# EAGLE schematic electronicProject (EAGLE 8.6.3)
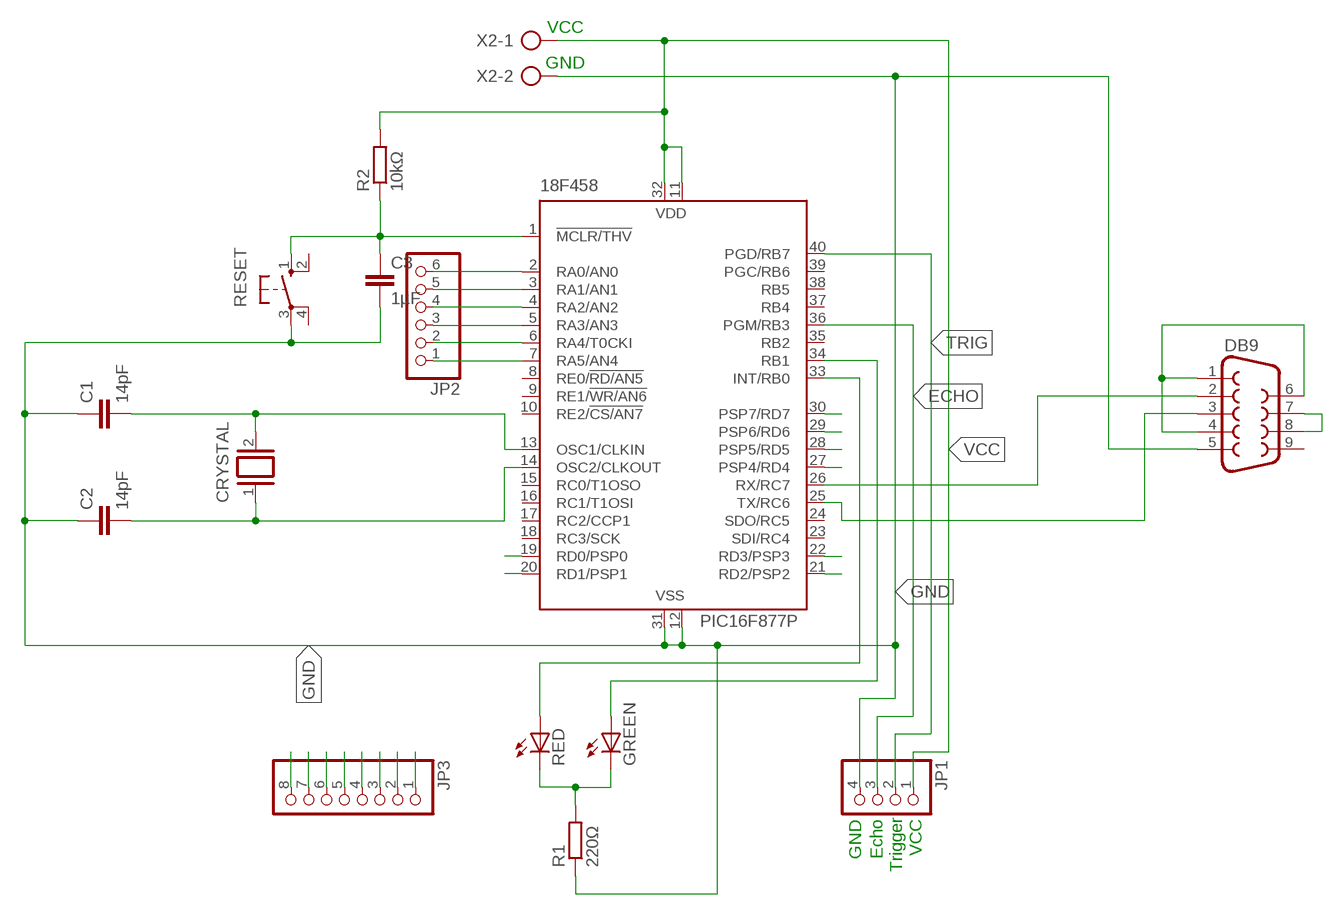
[diagram p0: schematic, sheet 1]

## Parts
18F458  PIC16F877P  [DIL40]
C1  14pF  C-EU025-024X044  [C025-024X044]
C2  14pF  C-EU025-024X044  [C025-024X044]
C3  1µF  C-EU025-024X044  [C025-024X044]
CRYSTAL  XTAL/S  [QS]
DB9  F09H  [F09H]
GREEN  LED3MM  [LED3MM]
JP1  PINHD-1X4  [1X04]
JP2  PINHD-1X6  [1X06]
JP3  PINHD-1X8  [1X08]
R1  220Ω  R-EU_0207/10  [0207/10]
R2  10kΩ  R-EU_0207/10  [0207/10]
RED  LED3MM  [LED3MM]
RESET  10-XX  [B3F-10XX]
X2  AK300/2  [AK300/2]

## Nets
ECHO: 18F458.36(PGM/RB3) JP1.3
GND: 18F458.12(VSS) 18F458.31(VSS) C1.1 C2.1 C3.2 DB9.5 JP1.4 R1.1 RESET.3(P) X2.2
N$1: 18F458.34(RB1) GREEN.A
N$2: 18F458.33(INT/RB0) RED.A
N$3: 18F458.1(!MCLR/THV) C3.1 R2.1 RESET.1(S)
N$4: 18F458.2(RA0/AN0) JP2.6
N$5: 18F458.3(RA1/AN1) JP2.5
N$6: 18F458.4(RA2/AN2) JP2.4
N$7: DB9.1 DB9.4 DB9.6
N$8: 18F458.26(RX/RC7) DB9.2
N$9: DB9.7 DB9.8
N$10: 18F458.5(RA3/AN3) JP2.3
N$11: 18F458.25(TX/RC6) DB9.3
N$14: 18F458.6(RA4/T0CKI) JP2.2
N$15: 18F458.7(RA5/AN4) JP2.1
N$16: 18F458.13(OSC1/CLKIN) C1.2 CRYSTAL.2
N$17: 18F458.14(OSC2/CLKOUT) C2.2 CRYSTAL.1
N$18: GREEN.K(C) R1.2 RED.K(C)
RD0: 18F458.19(RD0/PSP0) JP3.8
RD1: 18F458.20(RD1/PSP1) JP3.7
RD2: 18F458.21(RD2/PSP2) JP3.6
RD3: 18F458.22(RD3/PSP3) JP3.5
RD4: 18F458.27(PSP4/RD4) JP3.4
RD5: 18F458.28(PSP5/RD5) JP3.3
RD6: 18F458.29(PSP6/RD6) JP3.2
RD7: 18F458.30(PSP7/RD7) JP3.1
TRIG: 18F458.40(PGD/RB7) JP1.2
VCC: 18F458.11(VDD) 18F458.32(VDD) JP1.1 R2.2 X2.1
Unconnected: 18F458.8(RE0/!RD/AN5) 18F458.9(RE1/!WR/AN6) 18F458.10(RE2/!CS/AN7) 18F458.15(RC0/T1OSO) 18F458.16(RC1/T1OSI) 18F458.17(RC2/CCP1) 18F458.18(RC3/SCK) 18F458.23(SDI/RC4) 18F458.24(SDO/RC5) 18F458.35(RB2) 18F458.37(RB4) 18F458.38(RB5) 18F458.39(PGC/RB6) DB9.9 RESET.2(S1) RESET.4(P1)

## Notes on the sheet
- VCC
- GND
- GND | Echo | Trigger | VCC

## Library data of the parts
18F458 = microchip:PIC16F87*: MICROCONTROLLER; MF: MICROCHIP; MPN: PIC16F877-04/P; OC_FARNELL: 9761349; OC_NEWARK: 61K3463
C1-C3 = rcl:C-EU: CAPACITOR, European symbol; SPICEPREFIX: C
CRYSTAL = special:XTAL/S: CRYSTAL
DB9 = con-subd:F09: SUB-D; OC_FARNELL: unknown; OC_NEWARK: unknown
GREEN RED = led:LED: LED OSRAM: - CHIPLED LG R971, LG N971, LY N971, LG Q971, LY Q971, LO R971, LY R971 LH N974, LH R974 LS Q976, LO Q976, LY Q976 LO Q996 - Hyper CHIPLED LW Q18S LB Q993, LB Q99A, LB R99A - SideLED LS A670, LO A670, LY A670, LG A670, LP A670 LB A673, LV A673, LT A673, LW A673 LH A674 LY A675 LS A676, LA A676, LO A676, LY A676, LW A676 LS A679, LY A679, LG A679 - Hyper Micro SIDELED® LS Y876, LA Y876, LO Y876, LY Y876 LT Y87S - SmartLED LW L88C, LW L88S LB L89C, LB L89S, LG L890 LS L89K, LO L89K, LY L89K LS L896, LA L896, LO L896, LY L896 - TOPLED LS T670, LO T670, LY T670, LG T670, LP T670 LSG T670, LSP T670, LSY T670, LOP T670, LYG T670 LG T671, LOG T671, LSG T671 LB T673, LV T673, LT T673, LW T673 LH T674 LS T676, LA T676, LO T676, LY T676, LB T676, LH T676, LSB T676, LW T676 LB T67C, LV T67C, LT T67C, LS T67K, LO T67K, LY T67K, LW E67C LS E67B, LA E67B, LO E67B, LY E67B, LB E67C, LV E67C, LT E67C LW T67C LS T679, LY T679, LG T679 LS T770, LO T770, LY T770, LG T770, LP T770 LB T773, LV T773, LT T773, LW T773 LH T774 LS E675, LA E675, LY E675, LS T675 LS T776, LA T776, LO T776, LY T776, LB T776 LHGB T686 LT T68C, LB T68C - Hyper Mini TOPLED® LB M676 - Mini TOPLED Santana® LG M470 LS M47K, LO M47K, LY M47K Source: http://www.osram.convergy.de LUXEON: - LUMILED® LXK2-PW12-R00, LXK2-PW12-S00, LXK2-PW14-U00, LXK2-PW14-V00 LXK2-PM12-R00, LXK2-PM12-S00, LXK2-PM14-U00 LXK2-PE12-Q00, LXK2-PE12-R00, LXK2-PE12-S00, LXK2-PE14-T00, LXK2-PE14-U00 LXK2-PB12-K00, LXK2-PB12-L00, LXK2-PB12-M00, LXK2-PB14-N00, LXK2-PB14-P00, LXK2-PB14-Q00 LXK2-PR12-L00, LXK2-PR12-M00, LXK2-PR14-Q00, LXK2-PR14-R00 LXK2-PD12-Q00, LXK2-PD12-R00, LXK2-PD12-S00 LXK2-PH12-R00, LXK2-PH12-S00 LXK2-PL12-P00, LXK2-PL12-Q00, LXK2-PL12-R00 Source: www.luxeon.com KINGBRIGHT: KA-3528ASYC Source: www.kingbright.com
JP1 = pinhead:PINHD-1X4: PIN HEADER
JP2 = pinhead:PINHD-1X6: PIN HEADER
JP3 = pinhead:PINHD-1X8: PIN HEADER
R1 R2 = rcl:R-EU_: RESISTOR, European symbol; SPICEPREFIX: R
RESET = switch-omron:10-XX: OMRON SWITCH; MPN: B3F-1000; OC_FARNELL: 176432; OC_NEWARK: 36M3542
X2 = con-ptr500:AK300/2: CONNECTOR; OC_FARNELL: unknown; OC_NEWARK: unknown